# Altium schematic sheet RS485.SchDoc: RS485
size A4; DocumentNumber: 4; SheetNumber: 4; SheetTotal: 5
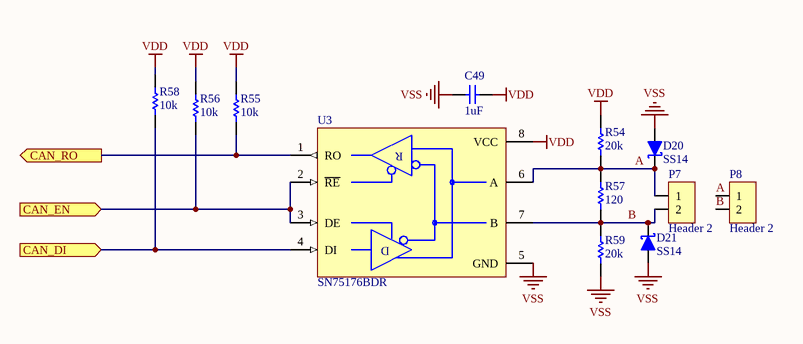
[diagram p0: RS485.SchDoc]

## Parts
C49  1uF  [C 0805]
D20  SS14  [DO-214AC (SMA)]
D21  SS14  [DO-214AC (SMA)]
P7  Header 2  [HDR/Terminal/2/5mm/RA]
P8  Header 2  [HDR/Terminal/2/5mm/RA]
R54  20k  [R 0805]
R55  10k  [R 0805]
R56  10k  [R 0805]
R57  120  [R 0805]
R58  10k  [R 0805]
R59  20k  [R 0805]
U3  SN75176BDR  [SOIC-8]

## Ports
CAN_DI (in), CAN_EN (in), CAN_RO (out)

## Nets
VDD: C49.1 R54.2 R55.1 R56.2 R58.2 U3.8(VCC)
VSS: C49.2 D20.1(A) D21.1(A) R59.1 U3.5(GND)
A: D20.2(K) P7.1 P8.1 R54.1 R57.2 U3.6(A)
B: D21.2(K) P7.2 P8.2 R57.1 R59.2 U3.7(B)
CAN_DI: R58.1 U3.4(DI) ; port CAN_DI
CAN_EN: R56.1 U3.2(~{RE}) U3.3(DE) ; port CAN_EN
CAN_RO: R55.2 U3.1(RO) ; port CAN_RO

## Notes on the sheet
- Title
- Size:
- Date:
- A4
- Number:
- Time:
- Revision:
- Sheet
- of
- NPN
- Lab
- File:
- (in symbol MAX485) R; D

## Library data of the parts
C49 = Capacitor NP: Capacitor non-pol
D20 D21 = Diode Schottky: Schottky Diode; Published: 8-Jun-2000; LatestRevisionDate: 17-Jul-2002; LatestRevisionNote: Re-released for DXP Platform.; PackageReference: SMB; Publisher: Altium Limited; Code_JEDEC: DO-214-AA
P7 P8 = Header 2: Header, 2-Pin; LatestRevisionDate: 17-Jul-2002; LatestRevisionNote: Re-released for DXP Platform.; Publisher: Altium Limited
R54-R59 = Resistor: Published: 8-Jun-2000; LatestRevisionDate: 17-Jul-2002; LatestRevisionNote: Re-released for DXP Platform.; PackageReference: AXIAL-0.3; Publisher: Altium Limited
U3 = MAX485